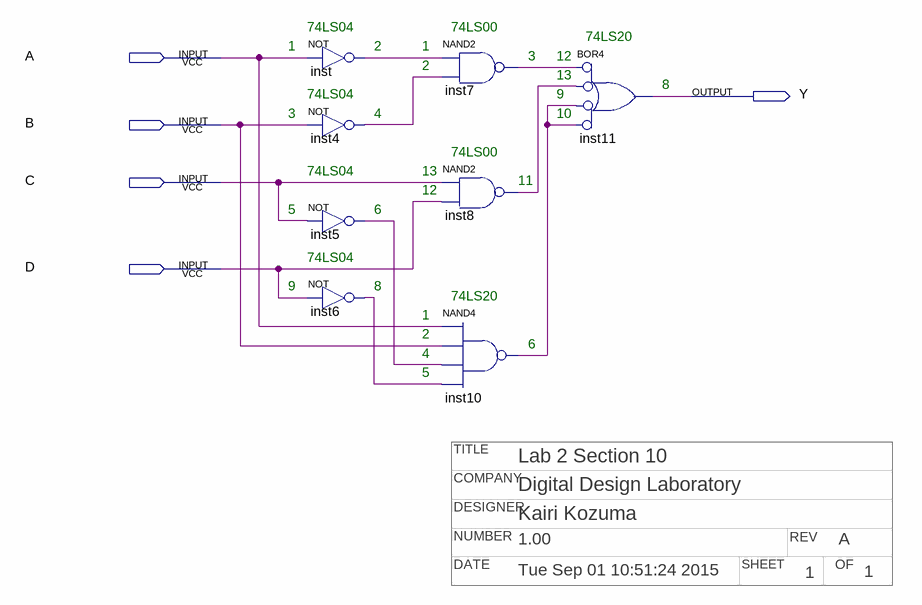
[diagram p0: schematic sheet]
// Quartus schematic lab_2.bdf as structural Verilog: 8 symbols, 5 pins
// Title block: TITLE: Lab 2 Section 10; COMPANY: Digital Design Laboratory; DESIGNER: Kairi Kozuma; NUMBER: 1.00; REV: A; DATE: Tue Sep 01 10:51:24 2015; SHEET: 1; OF: 1
module lab_2 (
  input  A,
  input  B,
  input  C,
  input  D,
  output Y
);

  wire inst4_out, inst5_out, inst6_out, inst7_out, inst8_out, inst10_out, inst_out;

  not inst (inst_out, A);
  not inst4 (inst4_out, B);
  not inst5 (inst5_out, C);
  not inst6 (inst6_out, D);
  nand inst7 (inst7_out, inst_out, inst4_out);
  nand inst8 (inst8_out, C, D);
  nand inst10 (inst10_out, A, B, inst5_out, inst6_out);
  or inst11 (Y, ~inst7_out, ~inst8_out, ~inst10_out, ~inst10_out);  // BOR4

  // Notes on the sheet:
  //   74LS04
  //   74LS00
  //   74LS20
  //   1
  //   2
  //   1
  //   3
  //   12
  //   2
  //   13
  //   8
  //   74LS04
  //   9
  //   3
  //   4
  //   10
  //   74LS00
  //   74LS04
  //   13
  //   11
  //   12
  //   5
  //   6
  //   74LS04
  //   9
  //   8
  //   74LS20
  //   1
  //   2
  //   6
  //   4
  //   5
endmodule
